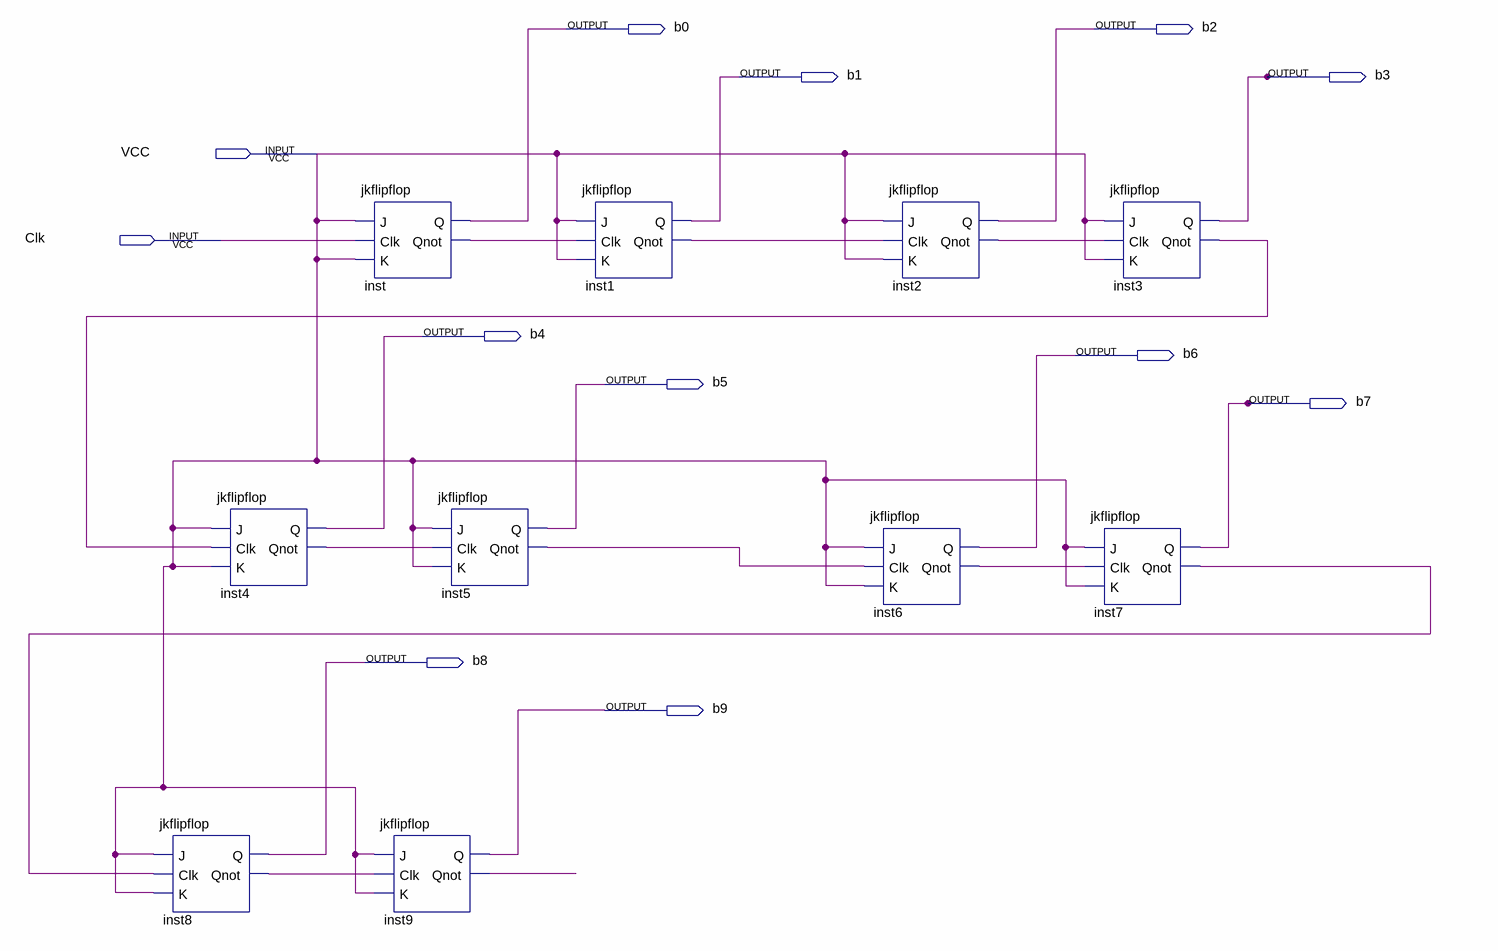
[diagram p0: schematic sheet]
// Quartus schematic 10bitcounter2.bdf as structural Verilog: 10 symbols, 12 pins
module \10bitcounter2  (
  input  VCC,
  input  Clk,
  output b0,
  output b2,
  output b1,
  output b3,
  output b4,
  output b6,
  output b5,
  output b7,
  output b8,
  output b9
);

  wire inst1_qnot, inst2_qnot, inst3_qnot, inst4_qnot, inst5_qnot, inst6_qnot, inst7_qnot, inst8_qnot,
       inst9_qnot, inst_qnot;

  jkflipflop inst8 (.J(VCC), .Clk(inst7_qnot), .K(VCC), .Q(b8), .Qnot(inst8_qnot));
  jkflipflop inst4 (.J(VCC), .Clk(inst3_qnot), .K(VCC), .Q(b4), .Qnot(inst4_qnot));
  jkflipflop inst (.J(VCC), .Clk(Clk), .K(VCC), .Q(b0), .Qnot(inst_qnot));
  jkflipflop inst9 (.J(VCC), .Clk(inst8_qnot), .K(VCC), .Q(b9), .Qnot(inst9_qnot));
  jkflipflop inst5 (.J(VCC), .Clk(inst4_qnot), .K(VCC), .Q(b5), .Qnot(inst5_qnot));
  jkflipflop inst1 (.J(VCC), .Clk(inst_qnot), .K(VCC), .Q(b1), .Qnot(inst1_qnot));
  jkflipflop inst2 (.J(VCC), .Clk(inst1_qnot), .K(VCC), .Q(b2), .Qnot(inst2_qnot));
  jkflipflop inst6 (.J(VCC), .Clk(inst5_qnot), .K(VCC), .Q(b6), .Qnot(inst6_qnot));
  jkflipflop inst3 (.J(VCC), .Clk(inst2_qnot), .K(VCC), .Q(b3), .Qnot(inst3_qnot));
  jkflipflop inst7 (.J(VCC), .Clk(inst6_qnot), .K(VCC), .Q(b7), .Qnot(inst7_qnot));
endmodule
